# Altium schematic sheet MotorController.SchDoc
size A; SheetNumber: 3
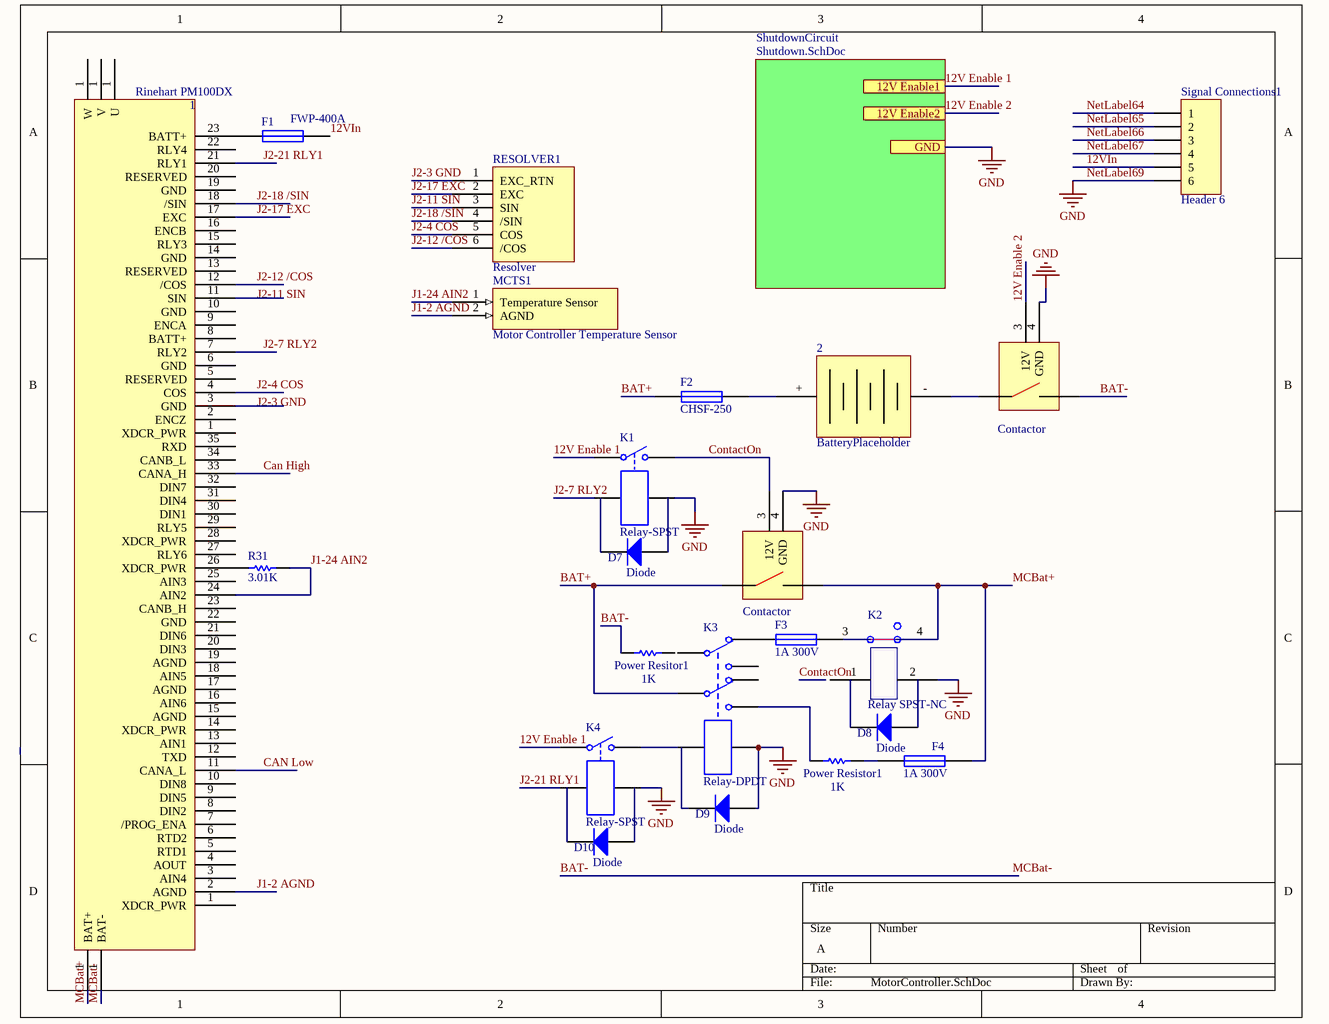
[diagram p0: MotorController.SchDoc]

## Parts
1  Rinehart PM100DX
2  BatteryPlaceholder
*1  Contactor
*2  Contactor
D7  Diode  [SMC]
D8  Diode  [SMC]
D9  Diode  [SMC]
D10  Diode  [SMC]
F1  FWP-400A  [PIN-W2/E2.8]
F2  CHSF-250  [PIN-W2/E2.8]
F3  1A 300V  [PIN-W2/E2.8]
F4  1A 300V  [PIN-W2/E2.8]
K1  Relay-SPST  [MODULE4]
K2  Relay SPST-NC
K3  Relay-DPDT  [DIP-P8]
K4  Relay-SPST  [MODULE4]
MCTS1  Motor Controller Temperature Sensor
Power_Resistor1  value 1K  [AXIAL-0.3]  (hidden comment: Res2)
Power_Resitor1  value 1K  [AXIAL-0.3]  (hidden comment: Res1)
R31  3.01K  [AXIAL-0.3]
RESOLVER1  Resolver
Signal_Connections1  Header 6  [HDR1X6]

## Sub-sheets
ShutdownCircuit = Shutdown.SchDoc: no entries

## Ports
12V Enable1, 12V Enable2, GND

## Nets
NetLabel69: *1.4(GND) *2.4(GND) D9.1(A) K1.4 K2.2 K3.8 K4.4 Signal_Connections1.6 ; port GND  [also labelled GND]
12V Enable 1: K1.1 K4.1 ; port 12V Enable1
12V Enable 2: *1.3(12V) ; port 12V Enable2
12VIn: F1.2 Signal_Connections1.5
BAT+: *2.1(+) F2.1 K3.4
BAT-: 1.1(BAT-) *1.2(-) Power_Resitor1.1  [also labelled MCBat-]
Can High: 1.33(CANA_H)
CAN Low: 1.11(CANA_L)
ContactOn: *2.3(12V) K1.2
J1-2 AGND: 1.2(AGND) MCTS1.2(AGND)
J1-24 AIN2: 1.24(AIN2) MCTS1.1(Temperature_Sensor) R31.2
J2-3 GND: RESOLVER1.1(EXC_RTN)
J2-4 COS: 1.4(AOUT) RESOLVER1.5(COS)
J2-7 RLY2: 1.7(/PROG_ENA) K1.3
J2-11 SIN: RESOLVER1.3(SIN)
J2-12 /COS: 1.12(TXD) RESOLVER1.6(/COS)
J2-17 EXC: 1.17(AGND) RESOLVER1.2(EXC)
J2-18 /SIN: 1.18(AIN5) RESOLVER1.4(/SIN)
J2-21 RLY1: 1.21(DIN6) K4.3
MCBat+: 1.1(XDCR_PWR) *2.2(-) F4.2 K2.4
NetLabel64: Signal_Connections1.1
NetLabel65: Signal_Connections1.2
NetLabel66: Signal_Connections1.3
NetLabel67: Signal_Connections1.4
Net1_23: 1.23(CANB_H) F1.1
Net1_26: 1.26(XDCR_PWR) R31.1
Net2_+: 2.+ F2.2
Net2_-: 2.- *1.1(+)
NetF3_2: F3.2 K2.3
NetF4_1: F4.1 Power_Resistor1.2
NetK3_6: K3.6 Power_Resistor1.1
NetK3_7: K3.7 K4.2

Not connected (* = marked no-connect by the designer): 1 3(AIN4) 5(RTD1) 6(RTD2) 8(DIN2) 9(DIN5) 10(DIN8) 13(AIN1) 14(XDCR_PWR) 15(AGND) 16(AIN6) 19(AGND) 20(DIN3) 22(GND) 25(AIN3) 27(RLY6) 28(XDCR_PWR) 29(RLY5) 30(DIN1) 31(DIN4) 32(DIN7) 34(CANB_L) 35(RXD); D7 1(A) 2(K); D8 1(A) 2(K); D9 2(K); D10 1(A) 2(K); F3 1; K2 1; K3 1 2 3 5; Power_Resitor1 2

## Notes on the sheet
- Labels drawn without touching a wire or pin: J2-3 GND, J2-11 SIN

## Library data of the parts
D7-D10 = Diode: Default Diode; Published: 8-Jun-2000; LatestRevisionDate: 17-Jul-2002; LatestRevisionNote: Re-released for DXP Platform.; PackageVersion: Sep-1996; PackageReference: SMC; Publisher: Altium Limited; PackageDescription: DO-214-AB/SMC; 2 C-Bend Leads; Body 7.9 x 5.9 mm, inc. leads (LxW); Code_JEDEC: DO-214-AB
F1-F4 = Fuse 1: Fuse; Published: 8-Jun-2000; LatestRevisionDate: 17-Jul-2002; LatestRevisionNote: Re-released for DXP Platform.; PackageReference: PIN-W2/E2.8; Publisher: Altium Limited; PackageDescription: Thru-Hole; 2 Leads
K1 K4 = Relay-SPST: Single-Pole Single-Throw Relay; Published: 24-Mar-1999; LatestRevisionDate: 17-Jul-2002; LatestRevisionNote: Re-released for DXP Platform.; PackageReference: MODULE4; Publisher: Altium Limited
K2 = Relay-SPST-NC
K3 = Relay-DPDT: Dual-Pole Dual-Throw Relay; Published: 24-Mar-1999; LatestRevisionDate: 17-Jul-2002; LatestRevisionNote: Re-released for DXP Platform.; PackageReference: DIP-P8; Publisher: Altium Limited; PackageDescription: Relay; 8 Leads
Power_Resistor1 Power_Resitor1 R31 = Res1: Resistor; Published: 8-Jun-2000; LatestRevisionDate: 17-Jul-2002; LatestRevisionNote: Re-released for DXP Platform.; PackageReference: AXIAL-0.3; Publisher: Altium Limited; PackageDescription: Axial Device, Thru-Hole; 2 Leads; 0.3 in Pin Spacing
Signal_Connections1 = Header 6: Header, 6-Pin; LatestRevisionDate: 17-Jul-2002; LatestRevisionNote: Re-released for DXP Platform.; Publisher: Altium Limited